# EAGLE design untitled (EAGLE 4.16)
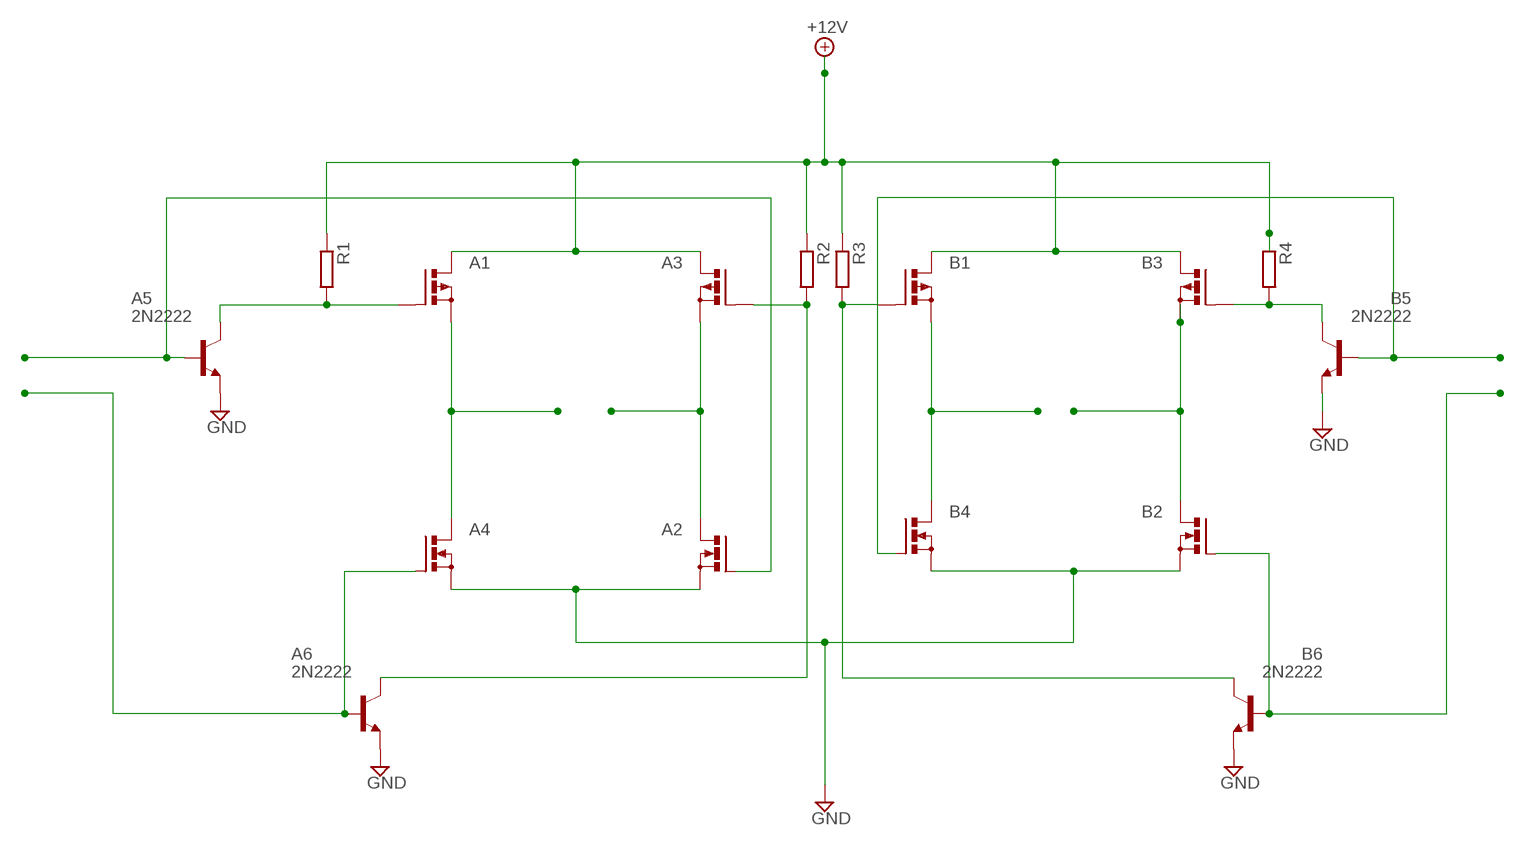
[diagram p0: schematic, sheet 1]

## Parts
A1  PMOSFET_PTO220BH  [TO220BH]
A2  PMOSFET_NTO220BH  [TO220BH]
A3  PMOSFET_PTO220BH  [TO220BH]
A4  PMOSFET_NTO220BH  [TO220BH]
A5  2N2222  [TO18]
A6  2N2222  [TO18]
B1  PMOSFET_PTO220BH  [TO220BH]
B2  PMOSFET_NTO220BH  [TO220BH]
B3  PMOSFET_PTO220BH  [TO220BH]
B4  PMOSFET_NTO220BH  [TO220BH]
B5  2N2222  [TO18]
B6  2N2222  [TO18]
R1  R-0603  [R0603]
R2  R-0603  [R0603]
R3  R-0603  [R0603]
R4  R-0603  [R0603]

## Nets
+12V: A1.S A3.S B1.S B3.S R1.1 R2.1 R3.1 R4.1
GND: A2.S A4.S A5.1(E) A6.1(E) B2.S B4.S B5.1(E) B6.1(E)
N$1: A1.D A4.D
N$2: B2.D B3.D
N$3: A1.G A5.3(C) R1.2
N$4: B1.D B4.D
N$5: A2.D A3.D
N$6: B3.G B5.3(C) R4.2
N$8: B4.G B5.2(B)
N$9: A3.G A6.3(C) R2.2
N$10: A2.G A5.2(B)
N$11: B1.G B6.3(C) R3.2
N$12: A4.G A6.2(B)
N$15: B2.G B6.2(B)

## Library data of the parts
A1 A3 B1 B3 = transistor-power:PMOSFET_P: Power MOSFET P-Channel
A2 A4 B2 B4 = transistor-power:PMOSFET_N: Power MOSFET N-Channel
A5 A6 B5 B6 = transistor:2N2222: NPN TRANSISTOR
R1-R4 = quantum-sensor:R: Resistor

## Board
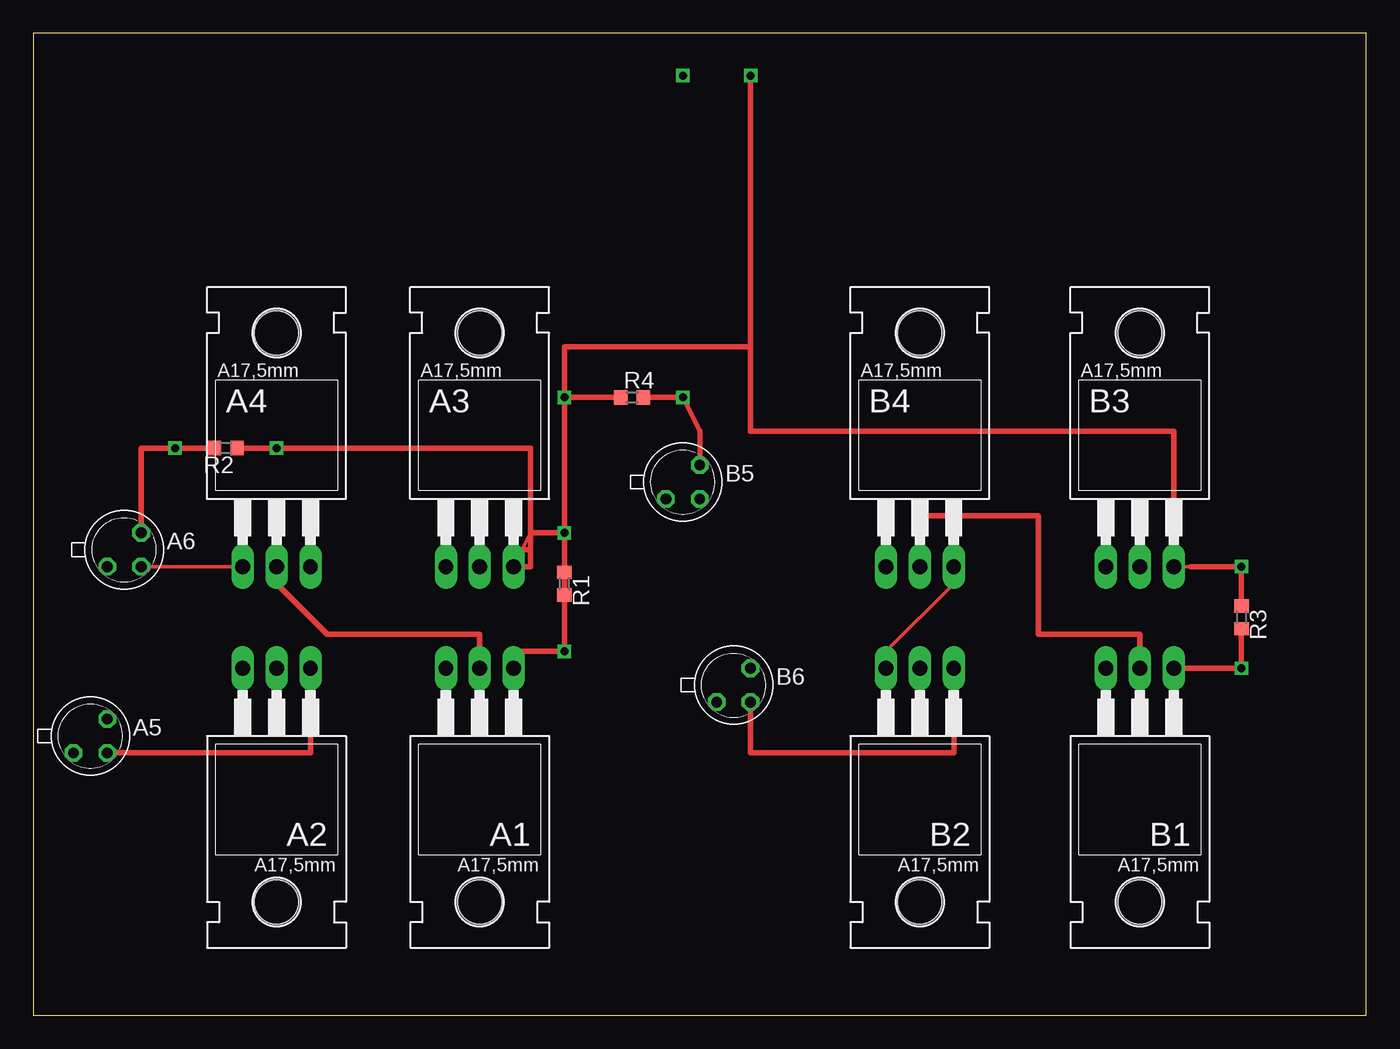
[diagram p1: board, top side]
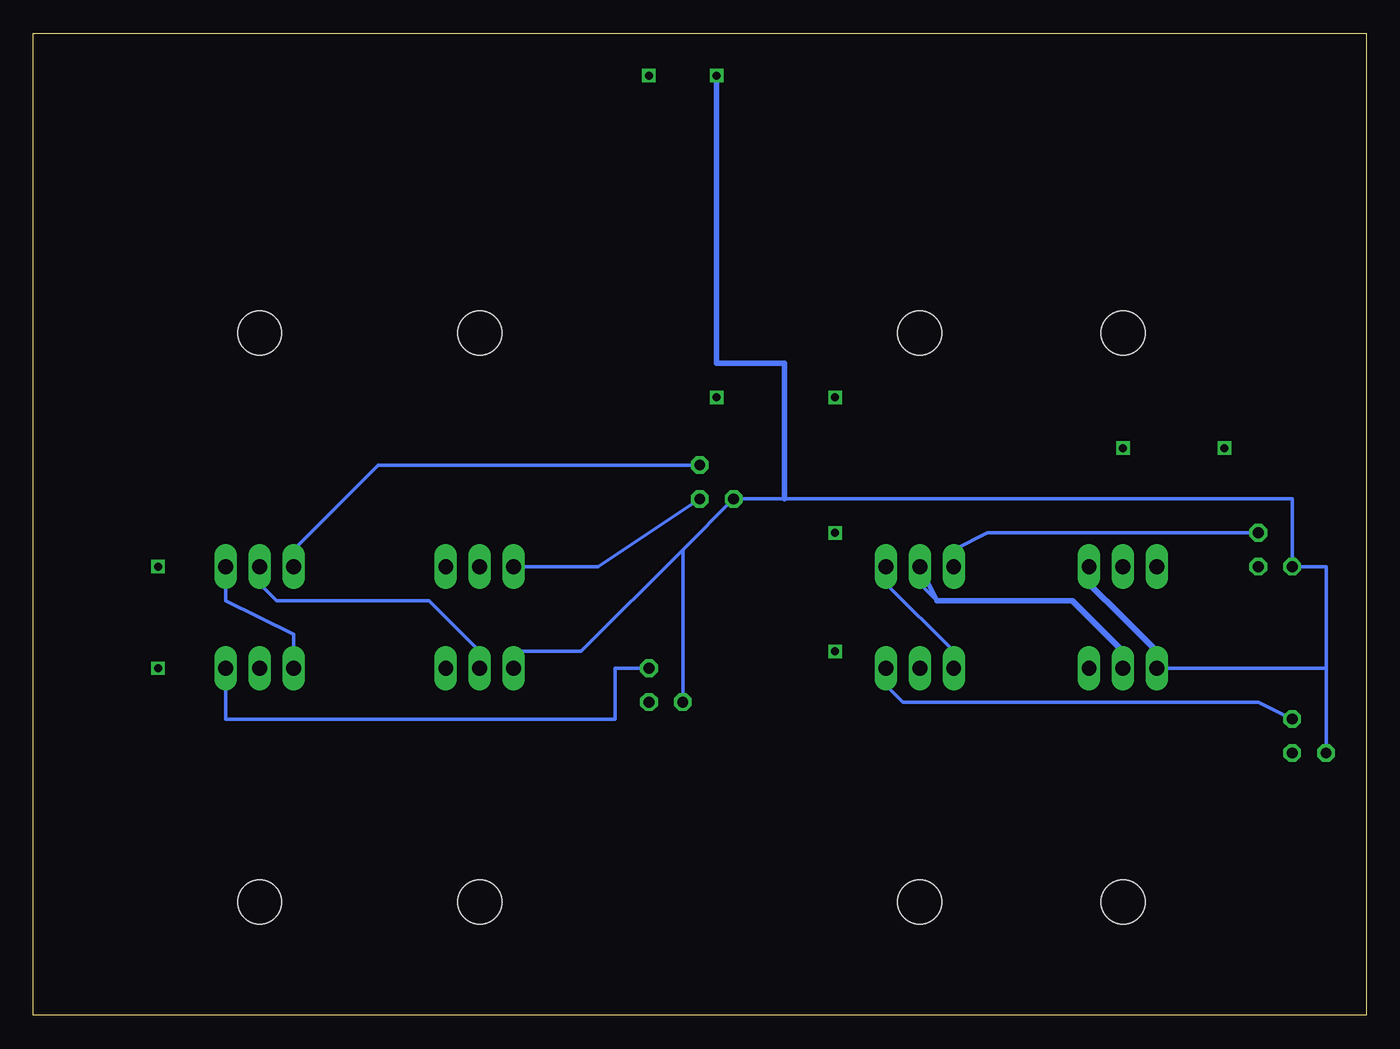
[diagram p2: board, bottom side, seen from below]

Size 100 x 73.65 mm. Coordinates in mm from the lower left corner, seen from the top.
Outline: 0,0 100,0 100,73.65 0,73.65 0,0
Copper layers (1*16): Top 0.035mm / dielectric 1.5mm / Bottom 0.035mm
Design rules "default": minimum track width 10mil, minimum drill 24mil, track to track 8mil, track to pad 8mil, pad to pad 8mil, via to via 8mil, smd to smd 8mil, copper to edge 40mil, drill to drill 8mil, minimum pad ring 10mil, minimum via ring 8mil, stop-mask expansion 4mil, vias tented up to drill 0mil, thermal gap 10mil

### Footprints (pad centres in the part's own frame; a part is rotated, then mirrored left to right if it is on the bottom)
TO220BH = drill 1.118 long: D 0,-6.35; G -2.54,-6.35; S 2.54,-6.35 | hole 3.302: 0,11.176
TO18 = drill 0.813 octagon: 1 -1.27,-1.27; 2 1.27,-1.27; 3 1.27,1.27
R0603 = smd 1 x 1.1: 1 -0.85,0; 2 0.85,0

### Placement (x,y rotation side)
A1  33.49,19.68 180 top
A2  18.25,19.68 180 top
A3  33.49,40 0 top
A4  18.25,40 0 top
A5  4.28,20.95 0 top
A6  6.82,34.92 0 top
B1  83.02,19.68 180 top
B2  66.51,19.68 180 top
B3  83.02,40 0 top
B4  66.51,40 0 top
B5  48.73,40 0 top
B6  52.54,24.76 0 top
R1  39.84,32.38 270 top
R2  14.44,42.54 180 top
R3  90.64,29.84 270 top
R4  44.92,46.35 0 top

### Tracks (layer width: path | path; a pad name or v marks a point on that pad's centre or on a via)
+12V  (via drill 0.6)
  Top 0.254: B3.S 86.83,33.65 | 90.64,31.11 R3.1 | R2.1 15.71,42.54 | 39.84,31.11 R1.1 | A3.S 37.3,36.19 37.3,42.54 | 43.65,46.35 R4.1
  Top 0.406: 53.81,50.16 v53.81,70.48 | 53.81,50.16 53.81,43.81 85.56,43.81 B3.S | 53.81,50.16 39.84,50.16 v39.84,46.35 | v39.84,36.19 v39.84,46.35 | v39.84,36.19 37.3,36.19 37.3,34.92 | 37.3,33.65 A3.S | 37.3,34.92 36.03,34.92 | 37.3,33.65 37.3,34.92 | 37.3,33.65 37.3,42.54 v18.25,42.54 15.71,42.54 | 86.83,33.65 v90.64,33.65 90.64,31.11 | v39.84,36.19 39.84,31.11 | v39.84,46.35 43.65,46.35
  Bottom 0.254: B1.S 80.48,28.57 85.56,31.11 B3.S | A1.S 30.95,27.3 36.03,32.38 A3.S
GND  (via drill 0.6)
  Top 0.254: B4.S 69.05,32.38 63.97,27.3 B2.S
  Bottom 0.254: 15.71,27.3 A2.S 3.01,26.03 | 20.79,32.38 A4.S | 3.01,26.03 3.01,33.65 A6.1 5.55,38.73 43.65,38.73 B5.1 51.27,34.92 | A5.1 3.01,26.03 | 51.27,34.92 58.89,27.3 63.97,27.3 B2.S | 51.27,34.92 B6.1
  Bottom 0.406: 43.65,38.73 43.65,48.89 48.73,48.89 v48.73,70.48 | 15.71,27.3 18.25,29.84 20.79,32.38
N$1
  Top 0.254: 33.49,27.3 A1.D
  Top 0.406: A4.D 18.25,32.38 22.06,28.57 33.49,28.57 33.49,27.3
N$2
  Bottom 0.254: B2.D 66.51,27.3 70.32,31.11 81.75,31.11 83.02,32.38 B3.D
N$3  (via drill 0.6)
  Top 0.254: 39.84,28.57 39.84,31.11 R1.2
  Top 0.406: v39.84,27.3 39.84,28.57 | v39.84,27.3 36.03,27.3 A1.G | v39.84,27.3 39.84,31.11
  Bottom 0.254: A5.3 8.09,23.49 34.76,23.49 36.03,24.76 A1.G
N$4
  Top 0.406: B4.D 66.51,37.46 75.4,37.46 75.4,28.57 83.02,28.57 B1.D
N$5
  Bottom 0.254: 32.22,31.11 33.49,32.38 A3.D
  Bottom 0.406: A2.D 18.25,27.3 22.06,31.11 32.22,31.11 A3.D
N$6  (via drill 0.6)
  Top 0.254: R4.2 46.19,46.35
  Top 0.406: 46.19,46.35 v48.73,46.35 50,43.81 B5.3
  Bottom 0.254: B5.3 74.13,41.27 80.48,34.92 B3.G
N$8
  Bottom 0.254: B5.2 57.62,33.65 B4.G
N$9  (via drill 0.6)
  Top 0.254: 13.17,42.54 R2.2
  Top 0.406: A6.3 8.09,42.54 v10.63,42.54 13.17,42.54
  Bottom 0.254: A6.3 28.41,36.19 30.95,34.92 A3.G
N$10
  Top 0.254: 20.79,24.76 A2.G
  Top 0.406: 20.79,24.76 20.79,19.68 A5.2
N$11  (via drill 0.6)
  Top 0.254: 90.64,28.57 R3.2
  Top 0.406: B1.G v90.64,26.03 90.64,28.57
  Bottom 0.254: B6.3 56.35,26.03 56.35,22.22 85.56,22.22 B1.G
N$12
  Top 0.254: A6.2 A4.G
N$15
  Top 0.406: B2.G 69.05,19.68 53.81,19.68 B6.2